# EAGLE design Step-to-TalkV2 (EAGLE 8.2.2)
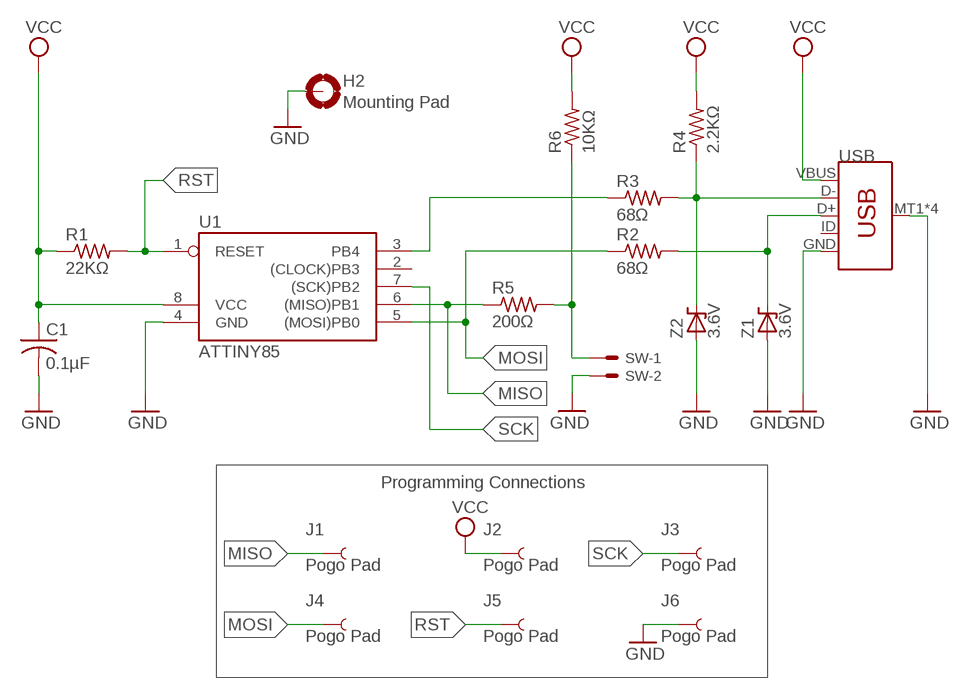
[diagram p0: schematic, sheet 1]

## Parts
C1  0.1µF  C-USC0603  [C0603]
H2  Mounting Pad  MOUNT-PAD-ROUND4.3  [4,3-PAD]
J1  Pogo Pad  TEST-POINT3  [PAD.03X.03]
J2  Pogo Pad  TEST-POINT3  [PAD.03X.03]
J3  Pogo Pad  TEST-POINT3  [PAD.03X.03]
J4  Pogo Pad  TEST-POINT3  [PAD.03X.03]
J5  Pogo Pad  TEST-POINT3  [PAD.03X.03]
J6  Pogo Pad  TEST-POINT3  [PAD.03X.03]
R1  22KΩ  R-US_R0603  [R0603]
R2  68Ω  R-US_R0603  [R0603]
R3  68Ω  R-US_R0603  [R0603]
R4  2.2KΩ  R-US_R0603  [R0603]
R5  200Ω  R-US_R0603  [R0603]
R6  10KΩ  R-US_R0603  [R0603]
SW  87438-02  [87438-02]
U1  ATTINY85  TINY22S  [SOIC8]
USB  USB_MICRO-B_SMT  [USB-MICROB]
Z1  3.6V  BZT52C3V6TENLARGED  [SOD523-ENLARGED]
Z2  3.6V  BZT52C3V6TENLARGED  [SOD523-ENLARGED]

## Nets
D+: R2.2 USB.D+ Z1.1(K)
D-: R3.2 R4.1 USB.D- Z2.1(K)
GND: C1.2 H2.B4,3(MOUNT) J6.P$1 SW.2 U1.4(GND) USB.GND USB.MT1(SHIELD) USB.MT2(SHIELD) USB.P$1(SHIELD) USB.P$2(SHIELD) Z1.2(A) Z2.2(A)
MISO: J1.P$1 R5.1 U1.6((MISO)PB1)
MOSI: J4.P$1 R2.1 U1.5((MOSI)PB0)
N$2: R3.1 U1.3(PB4)
N$4: R5.2 R6.1 SW.1
RST: J5.P$1 R1.2 U1.1(RESET)
SCK: J3.P$1 U1.7((SCK)PB2)
VCC: C1.1 J2.P$1 R1.1 R4.2 R6.2 U1.8(VCC) USB.VBUS
Unconnected: U1.2((CLOCK)PB3) USB.ID

## Notes on the sheet
- Programming Connections

## Library data of the parts
C1 = adafruit:C-US: CAPACITOR, American symbol
H2 = holes:MOUNT-PAD-ROUND: MOUNTING PAD, round
J1-J6 = SparkFun-Connectors:TEST-POINT: SparkFun Test Points Bare copper test points for troubleshooting or In-Circuit-Testing. These are used by our Production team for verifying production board runs using pogo-pins on test beds. SparkFun Products: SparkFun LSM9DS1 Breakout <https://www.sparkfun.com/products/13284> SparkFun PSOC <https://www.sparkfun.com/products/13714> SparkFun Load Cell Amplifier <https://www.sparkfun.com/products/13879>
R1-R6 = adafruit:R-US_: RESISTOR, American symbol
SW = con-molex:87438-02: Wire-to-Board 1.50mm (.059") Pitch Header - Right Angle, SMT, Shrouded Source: http://www.molex.com/product/micro/87438.html; OC_FARNELL: 1711327; OC_NEWARK: unknown
U1 = atmel:TINY22: MICROCONTROLLER 1K ROM 128 bytes RAM 128 bytes EEPROM; OC_FARNELL: unknown; OC_NEWARK: unknown
USB = SparkFun-Connectors:USB_MICRO-B: USB Type Micro-B Connector Male/female and PTH/SMT variants SparkFun Products: SparkFun microB USB Breakout <https://www.sparkfun.com/products/12035> SparkFun USB microB Plug Breakout <https://www.sparkfun.com/products/10031> SparkFun ESP8266 Thing <https://www.sparkfun.com/products/13231>; PROD_ID: CONN-09505; SF_ID: PRT-08533
Z1 Z2 = gjennings:BZT52C3V6T: Surface Mount Zener Diode

## Board
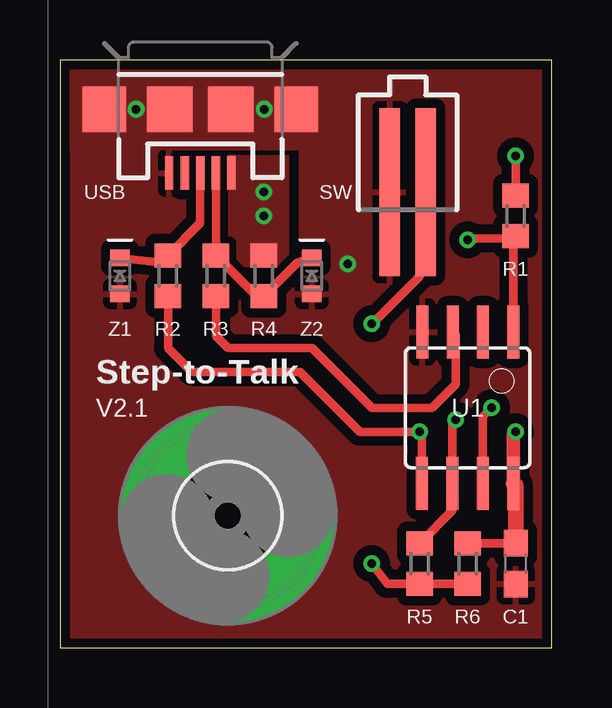
[diagram p1: board, top side]
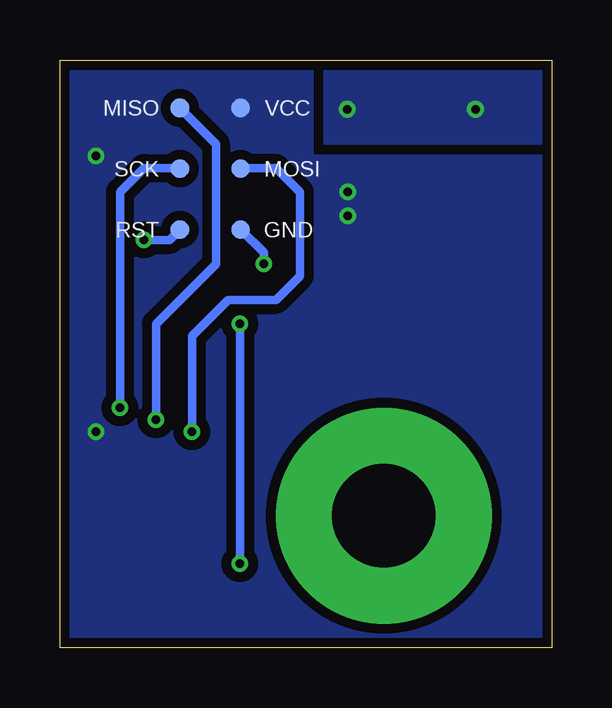
[diagram p2: board, bottom side, seen from below]

Size 20.5 x 24.5 mm. Coordinates in mm from the lower left corner, seen from the top.
Outline: 0,0 20.5,0 20.5,24.5 0,24.5 0,0
Copper layers (1*16): Top 0.0356mm / dielectric 1.5011mm / Bottom 0.0356mm
Design rules "oshpark-2layer *": minimum track width 6mil, minimum drill 13mil, track to track 6mil, track to pad 6mil, pad to pad 6mil, via to via 6mil, smd to smd 6mil, copper to edge 15mil, drill to drill 6mil, minimum pad ring 12mil, minimum via ring 7mil, stop-mask expansion 2.5mil, vias tented up to drill 25mil, thermal gap 12mil

### Footprints (pad centres in the part's own frame; a part is rotated, then mirrored left to right if it is on the bottom)
C0603 = smd 1.1 x 1: 1 -0.85,0; 2 0.85,0
4,3-PAD = drill 4.3 pad 9: B4,3 0,0
PAD.03X.03 = smd 0.762 x 0.762: P$1 0,0
R0603 = smd 1 x 1.1: 1 -0.85,0; 2 0.85,0
87438-02 = smd 7 x 0.85: 1 0,0.75; 2 0,-0.75
SOIC8 = smd 0.5 x 2.2: 1 -1.905,-3.154; 2 -0.645,-3.154; 3 0.625,-3.154; 4 1.895,-3.154; 5 1.905,3.154; 6 0.635,3.154; 7 -0.635,3.154; 8 -1.905,3.154
USB-MICROB = smd 1.4 x 0.35: D+ -2.65,0; D- -2.65,-0.65; GND -2.65,1.3; ID -2.65,0.65; VBUS -2.65,-1.3 | smd 1.9 x 1.8: MT1 0,-4; MT2 0,4 | smd 1.9 x 1.9: P$1 0,-1.27; P$2 0,1.27
SOD523-ENLARGED = smd 0.7 x 0.8: 1 0.75,0; 2 -0.75,0

### Placement (x,y rotation side)
C1  19,3.5 270 top
H2  7,5.5 0 top
J1  15.5,22.5 0 bottom
J2  12.96,22.5 0 bottom
J3  15.5,19.96 0 bottom
J4  12.96,19.96 0 bottom
J5  15.5,17.42 0 bottom
J6  12.96,17.42 0 bottom
R1  19,18 270 top
R2  4.5,15.5 90 top
R3  6.5,15.5 90 top
R4  8.5,15.5 90 top
R5  15,3.5 270 top
R6  17,3.5 90 top
SW  14.5,19 270 top
U1  17,10 180 top
USB  5.85,22.44 90 top
Z1  2.5,15.5 90 top
Z2  10.5,15.5 90 top

### Tracks (layer width: path | path; a pad name or v marks a point on that pad's centre or on a via)
D+
  Top 0.36: Z1.1 4.2,16.05 R2.2 5.85,17.7 USB.D+
D-
  Top 0.36: USB.D- R3.2 8.2,14.65 R4.1 9.9,16.05 Z2.1
GND  (via drill 0.35)
  Bottom 0.36: J6.P$1 12,16.46 v12,16
  other vias: 3.17,22.44 8.52,22.44
  pour Top (isolate 0.4, rank 2): 0,24.5 20.5,24.5 20.5,0 0,0
  pour Top (isolate 0.4, no thermals): 5.5,10.5 9.5,10.5 12,8 12,3 9,0 4.5,0 1.5,3 1.5,8.5 3.5,10.5
  pour Top (no thermals): 0,24.5 12,24.5 12,20.8 0,20.8
  pour Bottom (isolate 0.4, rank 2, no thermals): 0,24.5 10,24.5 10,20.5 0,20.5
MISO  (via drill 0.35)
  Top 0.36: R5.1 16.36,5.71 U1.6 16.36,9.37 v16.5,9.5
  Bottom 0.36: v16.5,9.5 16.5,13.5 14,16 14,21 J1.P$1
MOSI  (via drill 0.35)
  Top 0.36: R2.1 4.5,12.5 5.5,11.5 10,11.5 12.5,9 v15,9 15.1,8.9 U1.5
  Bottom 0.36: v15,9 15,13 13.5,14.5 11.5,14.5 10.5,15.5 10.5,19 11.5,20 12.92,20 J4.P$1
N$2
  Top 0.36: R3.1 6.5,13 7,12.5 10.5,12.5 13,10 15.5,10 16.5,11 16.5,13.03 U1.3
N$4  (via drill 0.35)
  Top 0.36: R6.1 R5.2 13.65,2.65 v13,3.5 | SW.1 15,18.75 15,15.5 v13,13.5
  Bottom 0.36: v13,13.5 v13,3.5
RST  (via drill 0.35)
  Top 0.32: R1.2 18.91,17.05
  Top 0.36: U1.1 18.91,17.05 17.05,17.05 v17,17
  Bottom 0.36: v17,17 15.92,17 J5.P$1
SCK  (via drill 0.35)
  Top 0.36: U1.7 17.64,9.63 v18,10
  Bottom 0.36: v18,10 18,19 17,20 15.54,20 J3.P$1
VCC  (via drill 0.35)
  Top 0.36: R6.2 C1.1 | R1.1 v19,20.5
  Top 0.56: U1.8 18.91,8.9 v19,9
  Top 0.65: C1.1 19,6.75 U1.8
  other vias: 8.5,19 8.5,18
  pour Top (isolate 0.3, no thermals): 7,20.5 9.5,20.5 9.5,15.9 7,15.9
  pour Bottom (isolate 0.4, no thermals): 0,20.5 10,20.5 10,24.5 20.5,24.5 20.5,0 0,0

### Text on the board
tNames: Step-to-Talk | V2.1
bNames: VCC | MISO | MOSI | SCK | GND | RST